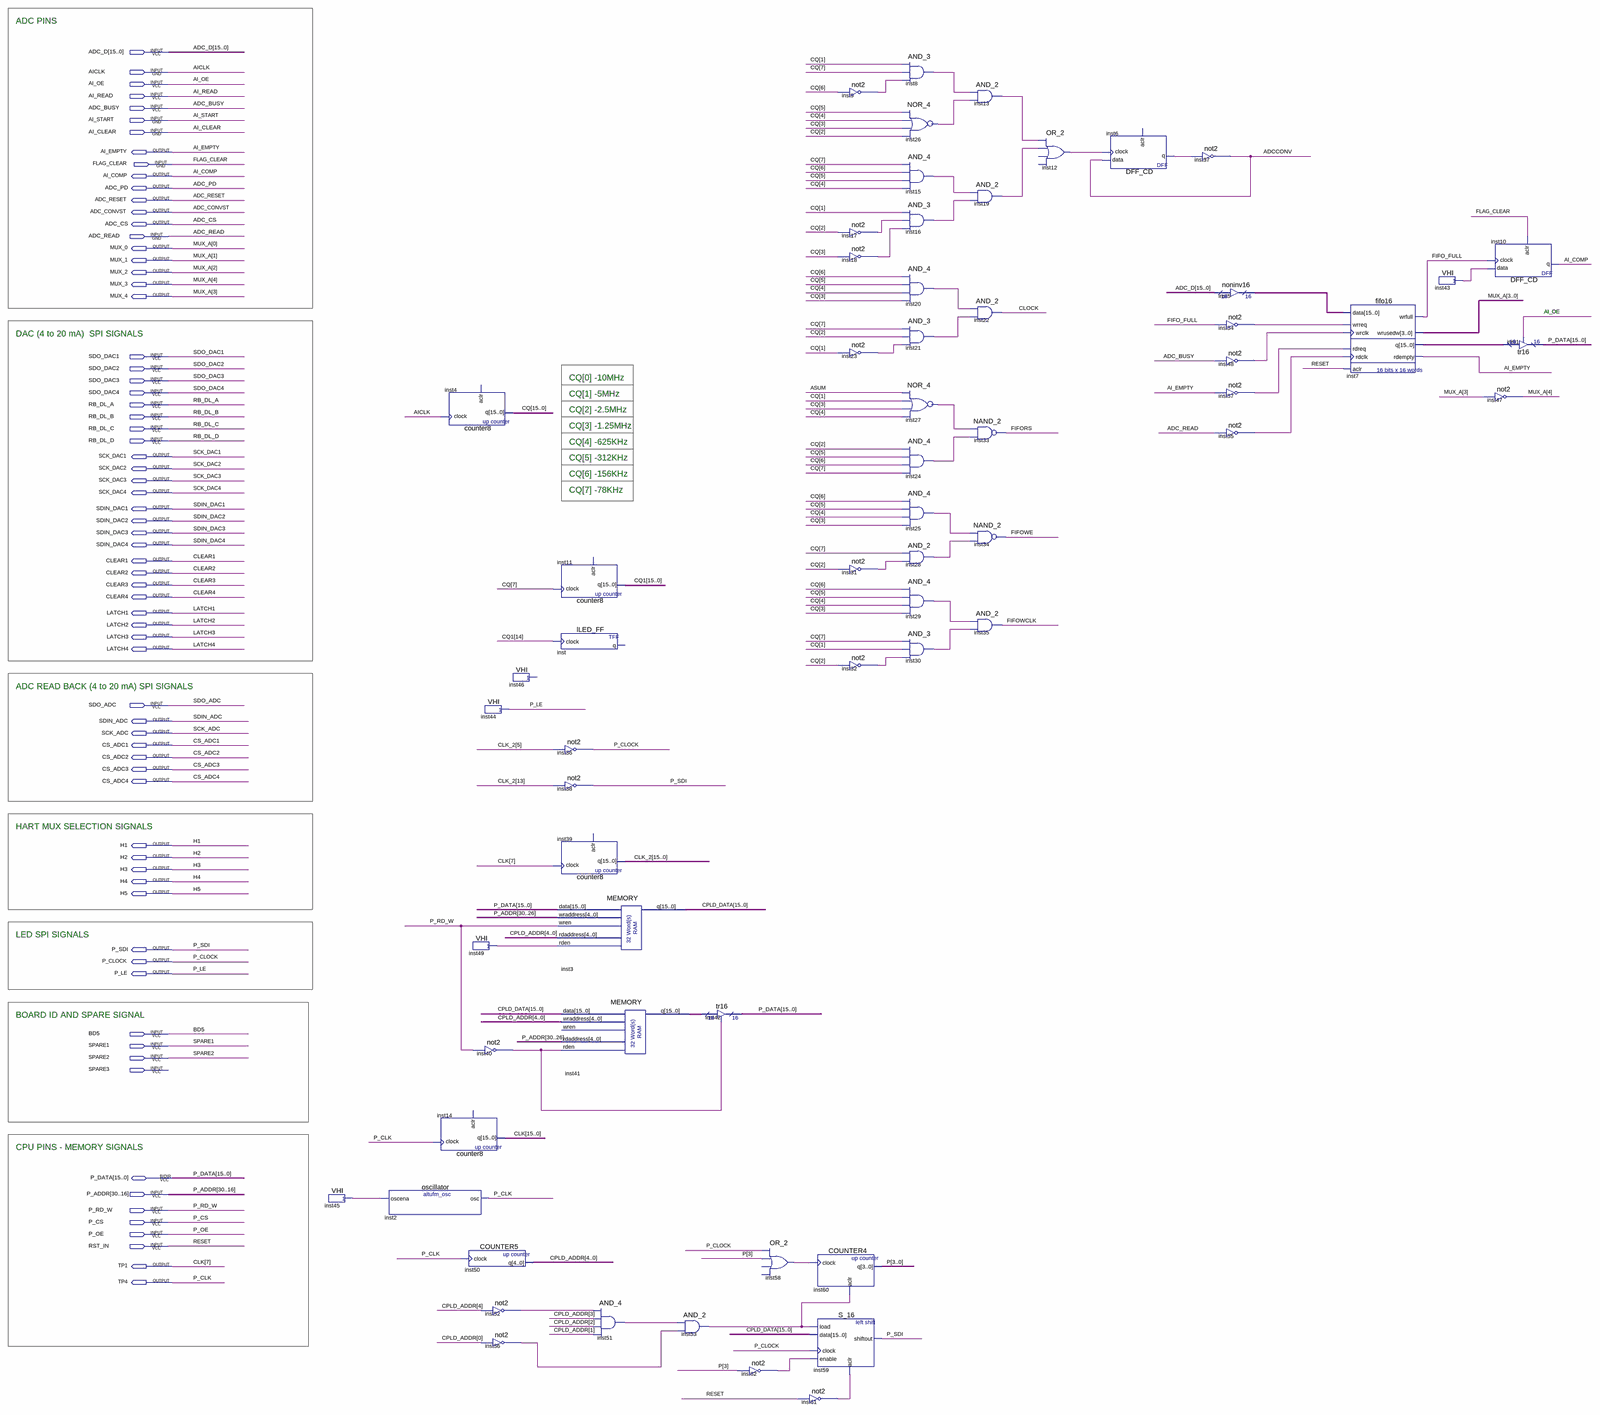
[diagram p0: schematic sheet, whole]
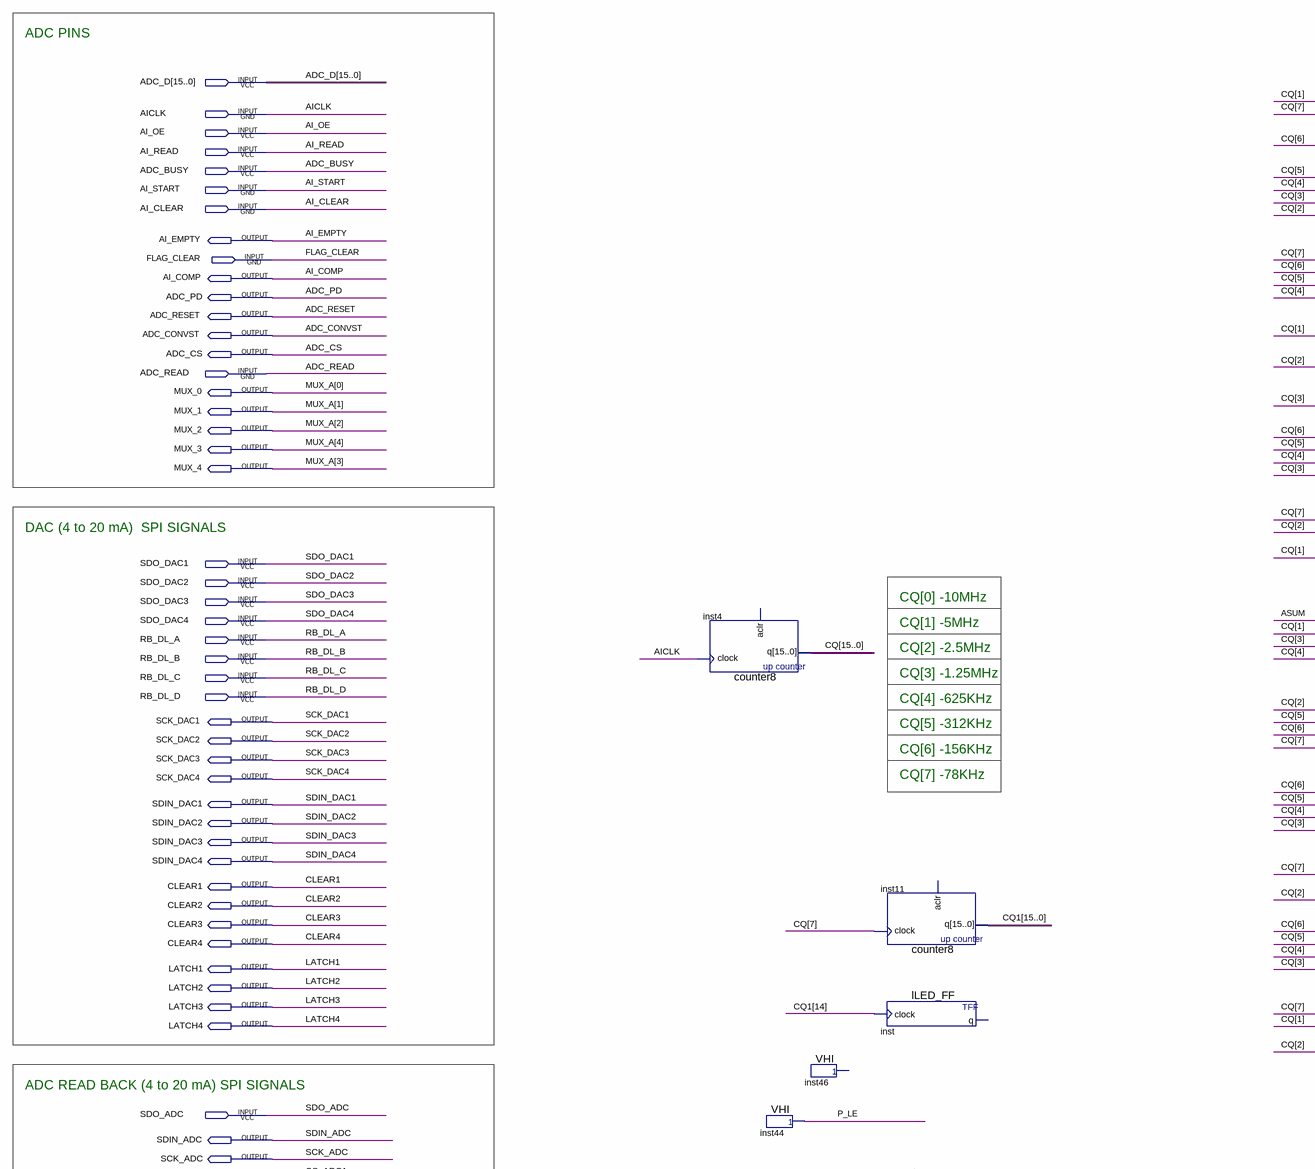
[diagram p1: schematic sheet, upper left part]
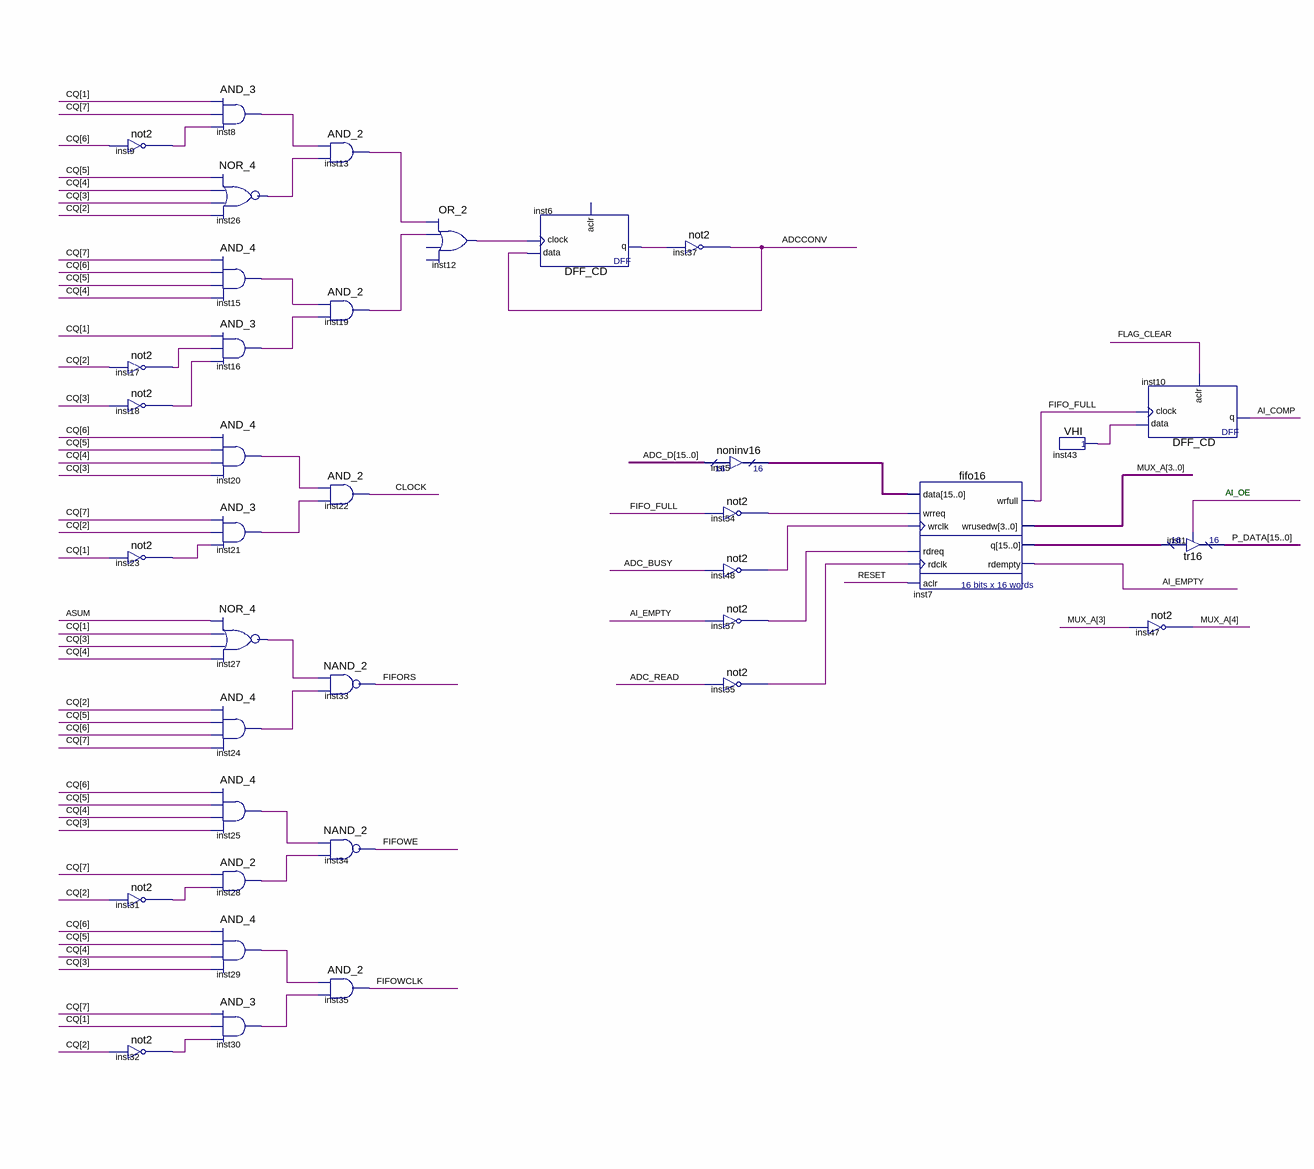
[diagram p2: schematic sheet, upper right part]
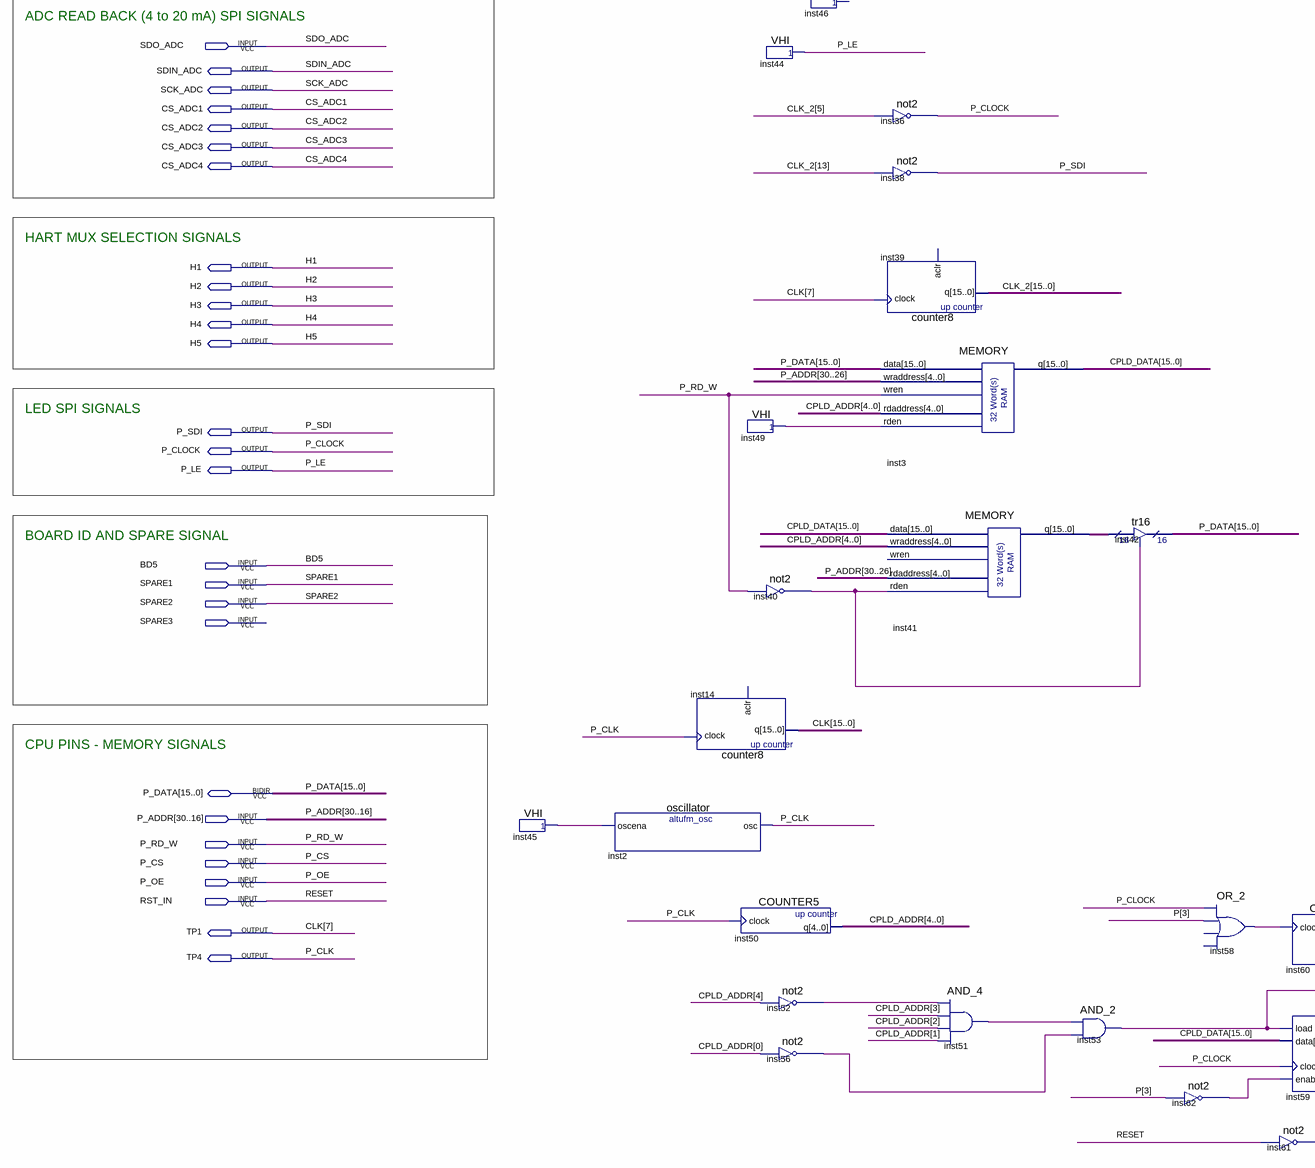
[diagram p3: schematic sheet, lower left part]
// Quartus schematic IOP.bdf as structural Verilog: 63 symbols, 71 pins
module IOP (
  input  [15:0] ADC_D,
  input  AICLK,
  input  AI_OE,
  input  AI_READ,
  input  ADC_BUSY,
  input  AI_START,
  input  AI_CLEAR,
  input  FLAG_CLEAR,
  input  ADC_READ,
  input  SDO_DAC1,
  input  SDO_DAC2,
  input  SDO_DAC3,
  input  SDO_DAC4,
  input  RB_DL_A,
  input  RB_DL_B,
  input  RB_DL_C,
  input  RB_DL_D,
  input  SDO_ADC,
  input  BD5,
  input  SPARE1,
  input  SPARE2,
  input  SPARE3,
  input  [30:16] P_ADDR,
  input  P_RD_W,
  input  P_CS,
  input  P_OE,
  input  RST_IN,
  inout  [15:0] P_DATA,
  output AI_EMPTY,
  output AI_COMP,
  output ADC_PD,
  output ADC_RESET,
  output ADC_CONVST,
  output ADC_CS,
  output MUX_0,
  output MUX_1,
  output MUX_2,
  output MUX_3,
  output MUX_4,
  output SCK_DAC1,
  output SCK_DAC2,
  output SCK_DAC3,
  output SCK_DAC4,
  output SDIN_DAC1,
  output SDIN_DAC2,
  output SDIN_DAC3,
  output SDIN_DAC4,
  output CLEAR1,
  output CLEAR2,
  output CLEAR3,
  output CLEAR4,
  output LATCH1,
  output LATCH2,
  output LATCH3,
  output LATCH4,
  output SDIN_ADC,
  output SCK_ADC,
  output CS_ADC1,
  output CS_ADC2,
  output CS_ADC3,
  output CS_ADC4,
  output H1,
  output H2,
  output H3,
  output H4,
  output H5,
  output P_SDI,
  output P_CLOCK,
  output P_LE,
  output TP1,
  output TP4
);

  wire ADCCONV, ASUM, CLOCK, FIFO_FULL, FIFORS, FIFOWCLK, FIFOWE, inst6_q, inst8_result, inst9_result,
       inst12_result, inst13_result, inst15_result, inst16_result, inst17_result, inst18_result,
       inst19_result, inst20_result, inst21_result, inst23_result, inst24_result, inst25_result,
       inst26_result, inst27_result, inst28_result, inst29_result, inst30_result, inst31_result,
       inst32_result, inst40_result, inst43_result, inst45_result, inst48_result, inst49_result,
       inst51_result, inst52_result, inst53_result, inst54_result, inst55_result, inst56_result,
       inst57_result, inst58_result, inst61_result, inst62_result;
  wire [3:0] P;
  wire [4:0] CPLD_ADDR;
  wire [15:0] CLK, CLK_2, CPLD_DATA, CQ, CQ1, inst5_output, inst7_q, inst41_q;

  VHI inst45 (.result(inst45_result));
  oscillator inst2 (.oscena(inst45_result), .osc(TP4));
  counter8 inst4 (.clock(AICLK), .q(CQ));  // open: aclr
  counter8 inst14 (.clock(TP4), .q({CLK[15:8], TP1, CLK[6:0]}));  // open: aclr
  VHI inst44 (.result(P_LE));
  VHI inst49 (.result(inst49_result));
  not2 inst40 (.data(P_RD_W), .result(inst40_result));
  COUNTER5 inst50 (.clock(TP4), .q(CPLD_ADDR));
  not2 inst52 (.data(CPLD_ADDR[4]), .result(inst52_result));
  not2 inst56 (.data(CPLD_ADDR[0]), .result(inst56_result));
  VHI inst46 ();  // open: result
  counter8 inst11 (.clock(CQ[7]), .q(CQ1));  // open: aclr
  lLED_FF inst (.clock(CQ1[14]));  // open: q
  not2 inst36 (.data(CLK_2[5]), .result(P_CLOCK));
  not2 inst38 (.data(CLK_2[13]), .result(P_SDI));
  counter8 inst39 (.clock(TP1), .q(CLK_2));  // open: aclr
  MEMORY inst3 (
    .data(P_DATA), .wraddress(P_ADDR[30:26]), .wren(P_RD_W), .rdaddress(CPLD_ADDR), .rden(inst49_result),
    .q(CPLD_DATA));
  MEMORY inst41 (
    .data(CPLD_DATA), .wraddress(CPLD_ADDR), .rdaddress(P_ADDR[30:26]), .rden(inst40_result), .q(inst41_q));  // open: wren
  AND_4 inst51 (
    .data0(inst52_result), .data1(CPLD_ADDR[3]), .data2(CPLD_ADDR[2]), .data3(CPLD_ADDR[1]),
    .result(inst51_result));
  tr16 inst42 (.enabledt(inst40_result), .data(inst41_q), .tridata(P_DATA));
  AND_2 inst53 (.data0(inst51_result), .data1(inst56_result), .result(inst53_result));
  not2 inst62 (.data(P[3]), .result(inst62_result));
  OR_2 inst58 (.data0(P_CLOCK), .data1(P[3]), .result(inst58_result));  // open: data2, data3
  not2 inst61 (.data(RST_IN), .result(inst61_result));
  COUNTER4 inst60 (.clock(inst58_result), .aclr(inst53_result), .q(P));
  S_16 inst59 (
    .load(inst53_result), .data(CPLD_DATA), .clock(P_CLOCK), .enable(inst62_result), .aclr(inst61_result),
    .shiftout(P_SDI));
  not2 inst9 (.data(CQ[6]), .result(inst9_result));
  not2 inst17 (.data(CQ[2]), .result(inst17_result));
  not2 inst18 (.data(CQ[3]), .result(inst18_result));
  not2 inst23 (.data(CQ[1]), .result(inst23_result));
  not2 inst31 (.data(CQ[2]), .result(inst31_result));
  not2 inst32 (.data(CQ[2]), .result(inst32_result));
  AND_3 inst8 (.data0(CQ[1]), .data1(CQ[7]), .data2(inst9_result), .result(inst8_result));
  NOR_4 inst26 (.data0(CQ[5]), .data1(CQ[4]), .data2(CQ[3]), .data3(CQ[2]), .result(inst26_result));
  AND_4 inst15 (.data0(CQ[7]), .data1(CQ[6]), .data2(CQ[5]), .data3(CQ[4]), .result(inst15_result));
  AND_3 inst16 (.data0(CQ[1]), .data1(inst17_result), .data2(inst18_result), .result(inst16_result));
  AND_4 inst20 (.data0(CQ[6]), .data1(CQ[5]), .data2(CQ[4]), .data3(CQ[3]), .result(inst20_result));
  AND_3 inst21 (.data0(CQ[7]), .data1(CQ[2]), .data2(inst23_result), .result(inst21_result));
  NOR_4 inst27 (.data0(ASUM), .data1(CQ[1]), .data2(CQ[3]), .data3(CQ[4]), .result(inst27_result));
  AND_4 inst24 (.data0(CQ[2]), .data1(CQ[5]), .data2(CQ[6]), .data3(CQ[7]), .result(inst24_result));
  AND_4 inst25 (.data0(CQ[6]), .data1(CQ[5]), .data2(CQ[4]), .data3(CQ[3]), .result(inst25_result));
  AND_2 inst28 (.data0(CQ[7]), .data1(inst31_result), .result(inst28_result));
  AND_4 inst29 (.data0(CQ[6]), .data1(CQ[5]), .data2(CQ[4]), .data3(CQ[3]), .result(inst29_result));
  AND_3 inst30 (.data0(CQ[7]), .data1(CQ[1]), .data2(inst32_result), .result(inst30_result));
  AND_2 inst13 (.data0(inst8_result), .data1(inst26_result), .result(inst13_result));
  AND_2 inst19 (.data0(inst15_result), .data1(inst16_result), .result(inst19_result));
  AND_2 inst22 (.data0(inst20_result), .data1(inst21_result), .result(CLOCK));
  NAND_2 inst33 (.data0(inst27_result), .data1(inst24_result), .result(FIFORS));
  NAND_2 inst34 (.data0(inst25_result), .data1(inst28_result), .result(FIFOWE));
  AND_2 inst35 (.data0(inst29_result), .data1(inst30_result), .result(FIFOWCLK));
  OR_2 inst12 (.data0(inst13_result), .data1(inst19_result), .result(inst12_result));  // open: data2, data3
  DFF_CD inst6 (.data(ADCCONV), .clock(inst12_result), .q(inst6_q));  // open: aclr
  not2 inst37 (.data(inst6_q), .result(ADCCONV));
  noninv16 inst5 (.\input (ADC_D), .\output (inst5_output));
  not2 inst54 (.data(FIFO_FULL), .result(inst54_result));
  not2 inst48 (.data(ADC_BUSY), .result(inst48_result));
  not2 inst57 (.data(AI_EMPTY), .result(inst57_result));
  not2 inst55 (.data(ADC_READ), .result(inst55_result));
  fifo16 inst7 (
    .data(inst5_output), .wrreq(inst54_result), .wrclk(inst48_result), .rdreq(inst57_result),
    .rdclk(inst55_result), .aclr(RST_IN), .wrfull(FIFO_FULL), .wrusedw({MUX_4, MUX_2, MUX_1, MUX_0}),
    .q(inst7_q), .rdempty(AI_EMPTY));
  VHI inst43 (.result(inst43_result));
  DFF_CD inst10 (.data(inst43_result), .clock(FIFO_FULL), .aclr(FLAG_CLEAR), .q(AI_COMP));
  tr16 inst1 (.enabledt(AI_OE), .data(inst7_q), .tridata(P_DATA));
  not2 inst47 (.data(MUX_4), .result(MUX_3));

  // Other names for the same wires on the sheet: CLK[7] = TP1; MUX_A[4:0] = {MUX_3, MUX_4, MUX_2, MUX_1, MUX_0};
  //   P_CLK = TP4; RESET = RST_IN

  // Notes on the sheet:
  //   ADC PINS
  //   AI_OE
  //   AI_OE
  //   DAC (4 to 20 mA)  SPI SIGNALS
  //   CQ[0] -
  //   10MHz
  //   CQ[1] -
  //   5MHz
  //   CQ[2] -
  //   2.5MHz
  //   CQ[3] -
  //   1.25MHz
  //   CQ[4] -
  //   625KHz
  //   CQ[5] -
  //   312KHz
  //   CQ[6] -
  //   156KHz
  //   CQ[7] -
  //   78KHz
  //   ADC READ BACK (4 to 20 mA) SPI SIGNALS
  //   HART MUX SELECTION SIGNALS
  //   LED SPI SIGNALS
  //   BOARD ID AND SPARE SIGNAL
  //   CPU PINS - MEMORY SIGNALS
endmodule
